# EAGLE design USB_Interlock_V2 (EAGLE 7.1.0)
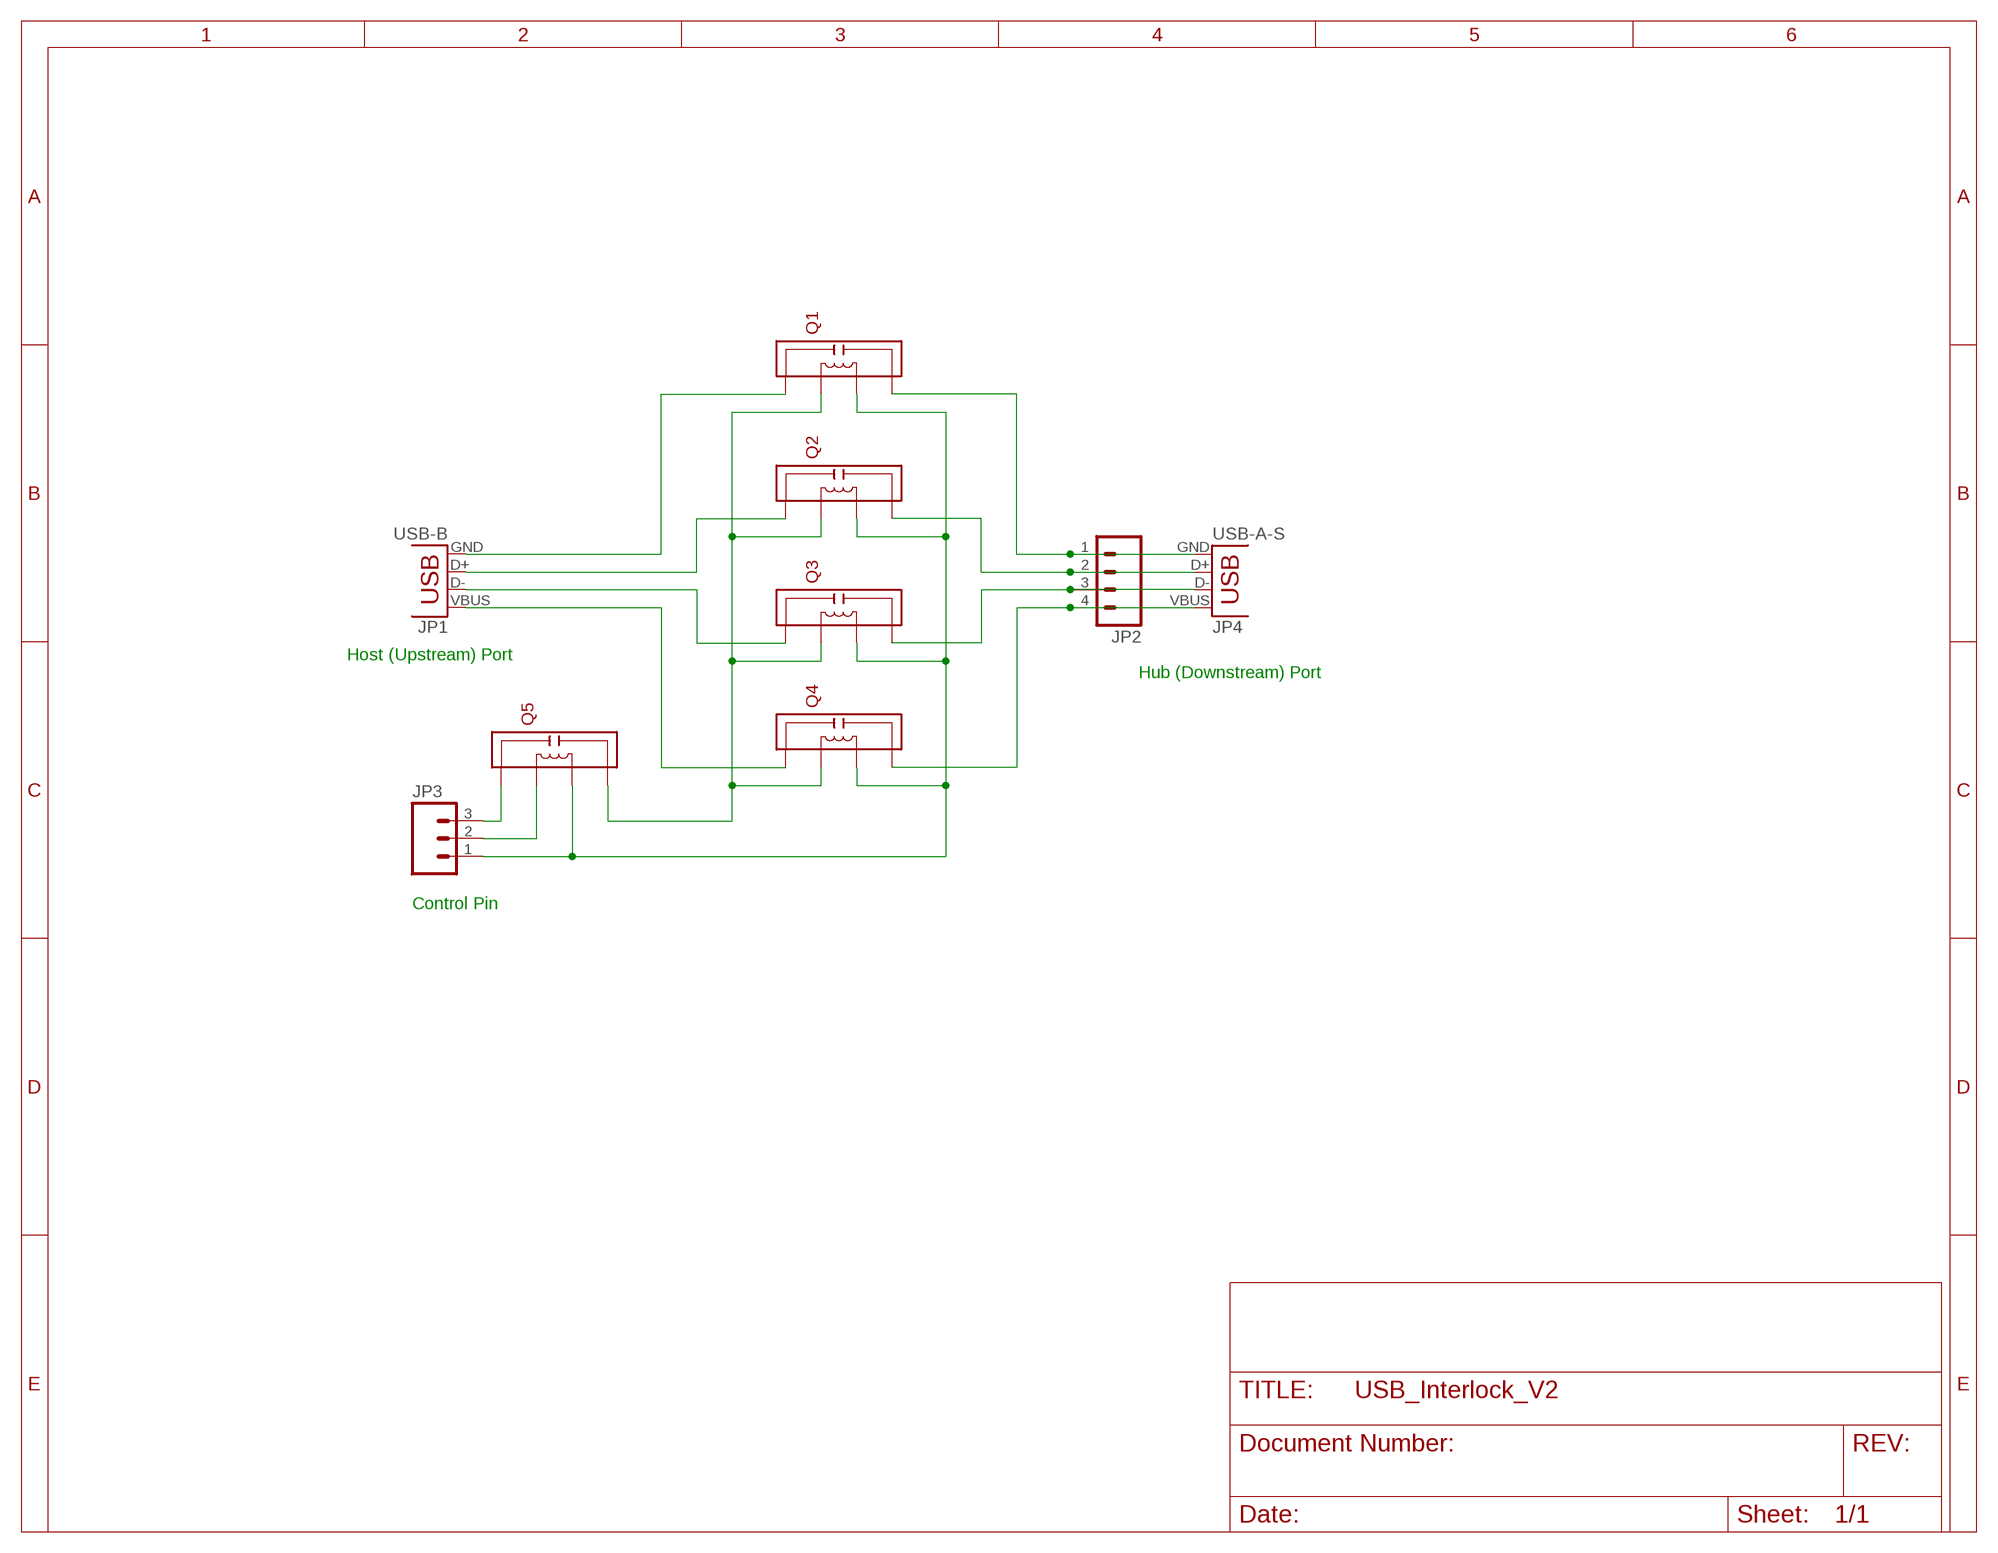
[diagram p0: schematic, sheet 1]

## Parts
JP1  USB-B  USBPTH  [USB-B-PTH]
JP2  M04LONGPADS  [1X04_LONGPADS]
JP3  M03LONGPADS  [1X03_LONGPADS]
JP4  USB-A-S  [USB-A-S]
Q1  9007-12-01  [9007-12-01]
Q2  9007-12-01  [9007-12-01]
Q3  9007-12-01  [9007-12-01]
Q4  9007-12-01  [9007-12-01]
Q5  9007-12-01  [9007-12-01]

## Nets
GND: JP3.1 Q1.P$3 Q2.P$3 Q3.P$3 Q4.P$3 Q5.P$3
HV1: JP2.3 JP4.D- Q3.P$4
HV2: JP2.2 JP4.D+ Q2.P$4
LV1: JP1.D- Q3.P$1
LV2: JP1.D+ Q2.P$1
N$1: JP3.3 Q5.P$1
N$2: JP3.2 Q5.P$2
N$3: Q1.P$2 Q2.P$2 Q3.P$2 Q4.P$2 Q5.P$4
N$4: JP1.GND Q1.P$1
N$6: JP2.1 JP4.GND Q1.P$4
N$9: JP1.VBUS Q4.P$1
V1: JP2.4 JP4.VBUS Q4.P$4

## Notes on the sheet
- Host (Upstream) Port
- Hub (Downstream) Port
- Control Pin

## Library data of the parts
JP1 = SparkFun-Connectors:USB: USB Connectors USB-B-PTH is fully proven SKU : PRT-00139/CONN-08278 USB-miniB is fully proven SKU : PRT-00587 USB-A-PCB is untested. USB-A-H is throughly reviewed, but untested. Spark Fun Electronics SKU : PRT-00437 USB-B-SMT is throughly reviewed, but untested. Needs silkscreen touching up. USB-A-S has not been used/tested USB-MB-H has not been used/tested USB-MICROB has been used. CONN-09505; PROD_ID: CONN-08278
JP2 = SparkFun-Connectors:M04: Header 4 Standard 4-pin 0.1" header. Use with straight break away headers (SKU : PRT-00116), right angle break away headers (PRT-00553), swiss pins (PRT-00743), machine pins (PRT-00117), and female headers (PRT-00115). Molex polarized connector foot print use with SKU : PRT-08231 with associated crimp pins and housings. 1MM SMD Version SKU: PRT-10208
JP3 = SparkFun-Connectors:M03: Header 3 Standard 3-pin 0.1" header. Use with straight break away headers (SKU : PRT-00116), right angle break away headers (PRT-00553), swiss pins (PRT-00743), machine pins (PRT-00117), and female headers (PRT-00115). Molex polarized connector foot print use with SKU : PRT-08232 with associated crimp pins and housings.
JP4 = SparkFun-Connectors:USB: USB Connectors USB-B-PTH is fully proven SKU : PRT-00139/CONN-08278 USB-miniB is fully proven SKU : PRT-00587 USB-A-PCB is untested. USB-A-H is throughly reviewed, but untested. Spark Fun Electronics SKU : PRT-00437 USB-B-SMT is throughly reviewed, but untested. Needs silkscreen touching up. USB-A-S has not been used/tested USB-MB-H has not been used/tested USB-MICROB has been used. CONN-09505
Q1-Q5 = BOC_Custom:9007-12-01: Economy SIP Reed Relay - http://media.digikey.com/pdf/Data%20Sheets/Coto%20Technology%20PDFS/9000_Spartan_Series.pdf

## Board
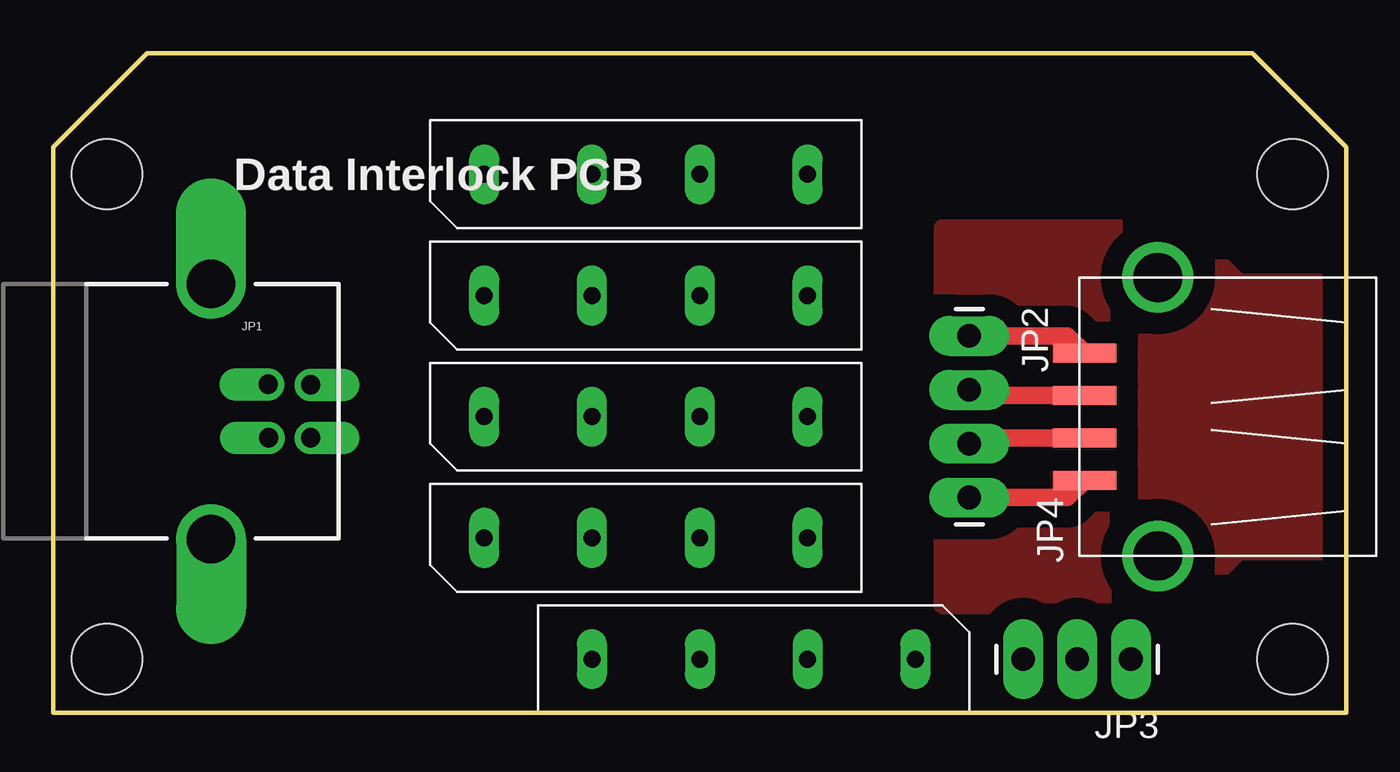
[diagram p1: board, top side]
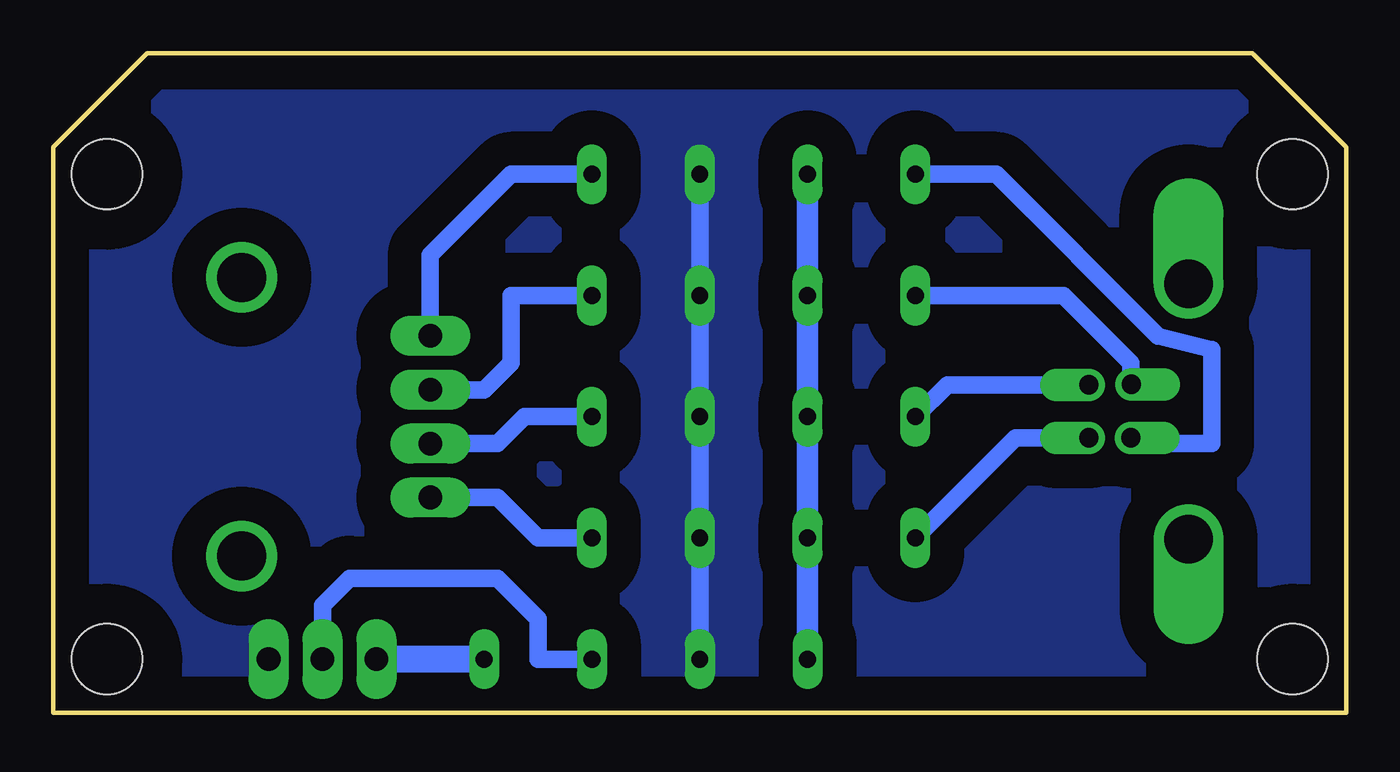
[diagram p2: board, bottom side, seen from below]

Size 60.96 x 31.11 mm. Coordinates in mm from the lower left corner, seen from the top.
Outline: 0,0 60.96,0 60.96,26.67 56.52,31.11 4.45,31.11 0,26.67 0,0
Copper layers (1*16): Top 0.035mm / dielectric 1.5mm / Bottom 0.035mm
Design rules "SparkFun *": minimum track width 24mil, minimum drill 20mil, track to track 18mil, track to pad 18mil, pad to pad 18mil, via to via 18mil, smd to smd 18mil, copper to edge 8mil, drill to drill 8mil, minimum pad ring 12mil, minimum via ring 10mil, stop-mask expansion 4mil, vias tented up to drill 20mil, thermal gap 16mil

### Footprints (pad centres in the part's own frame; a part is rotated, then mirrored left to right if it is on the bottom)
USB-B-PTH = drill 0.914 pad 1.422 offset: D+ -0.02,1.27; D- 1.981,1.25; GND 0,-1.25; VBUS 1.981,-1.25 | drill 2.286 offset: S1 -2.718,-6.02; S2 -2.718,6.02
1X04_LONGPADS = drill 1.118 pad 1.88 long: 1 0,0; 2 2.54,0; 3 5.08,0; 4 7.62,0
1X03_LONGPADS = drill 1.118 pad 1.88 long: 1 0,0; 2 2.54,0; 3 5.08,0
USB-A-S = smd 3 x 0.9: D+ 3.45,-1; D- 3.45,1; GND 3.45,-3; VBUS 3.45,3 | drill 2.311: P$5 0,-6.566; P$6 0,6.566
9007-12-01 = drill 0.8 pad 1.422 long: P$1 2.54,17.78; P$2 2.54,12.7; P$3 2.54,7.62; P$4 2.54,2.54
STAND-OFF = hole 3.302: 0,0

### Placement (x,y rotation side)
JP1  10.16,14.22 0 top
JP2  43.18,17.78 270 top
JP3  50.8,2.54 180 top
JP4  52.07,13.97 180 top
Q1  38.1,22.86 90 top
Q2  38.1,17.14 90 top
Q3  38.1,11.43 90 top
Q4  38.1,5.71 90 top
Q5  22.86,5.08 270 top
U$2  [STAND-OFF]  2.54,2.54 0 top
U$3  [STAND-OFF]  2.54,25.4 0 top
U$4  [STAND-OFF]  58.42,25.4 0 top
U$5  [STAND-OFF]  58.42,2.54 0 top

### Tracks (layer width: path | path; a pad name or v marks a point on that pad's centre or on a via)
GND
  Bottom 0.813: Q1.P$3 Q2.P$3 Q3.P$3 Q4.P$3 Q5.P$3
  pour Bottom (isolate 1.6, no thermals): 0,21.59 2.54,21.59 arc90 6.35,24.77 6.35,31.11 54.61,31.11 54.61,25.4 arc90 58.42,21.59 60.96,21.59 60.96,6.35 58.42,6.35 arc90 54.61,2.54 54.61,0 6.35,0 6.35,2.54 arc90 2.54,6.35 0,6.35
HV1
  Top 0.813: JP4.D- 43.45,12.97 JP2.3
  Bottom 0.813: Q3.P$4 38.73,13.97 40.01,12.7 JP2.3
HV2
  Top 0.813: JP4.D+ 43.45,14.97 JP2.2
  Bottom 0.813: Q2.P$4 39.37,19.68 39.37,16.51 40.64,15.24 JP2.2
LV1
  Bottom 0.813: JP1.D- 18.82,15.47 Q3.P$1
LV2
  Bottom 0.813: JP1.D+ 10.16,15.51 10.16,16.51 13.34,19.68 Q2.P$1
N$1
  Bottom 1.27: Q5.P$1 JP3.3
N$2
  Bottom 0.813: JP3.2 48.26,5.08 46.99,6.35 40.01,6.35 38.1,4.45 38.1,2.54 Q5.P$2
N$3
  Bottom 1.016: Q1.P$2 Q2.P$2 Q3.P$2 Q4.P$2 Q5.P$4
N$4
  Bottom 0.813: JP1.GND 9.89,12.7 6.35,12.7 6.35,17.14 8.89,17.78 16.51,25.4 Q1.P$1
N$5
  pour Bottom (isolate 1.6, no thermals): 0,0 60.96,0 60.96,27.94 57.15,31.75 3.17,31.75 0,27.94
N$6
  Top 0.813: JP2.1 47.81,17.78 JP4.GND
  Bottom 0.813: Q1.P$4 39.37,25.4 43.18,21.59 JP2.1
N$9
  Bottom 0.813: Q4.P$1 15.6,12.97 JP1.VBUS
N$10
  pour Top (isolate 1.016): 41.91,22.86 53.34,22.86 55.88,20.32 60.96,20.32 60.96,7.62 55.88,7.62 53.34,5.08 41.91,5.08
V1
  Top 0.813: JP2.4 47.81,10.16 JP4.VBUS
  Bottom 0.813: Q4.P$4 38.1,8.26 40.01,10.16 JP2.4

### Text on the board
tPlace: Data Interlock PCB